# EAGLE design io_board (EAGLE 7.2.0)
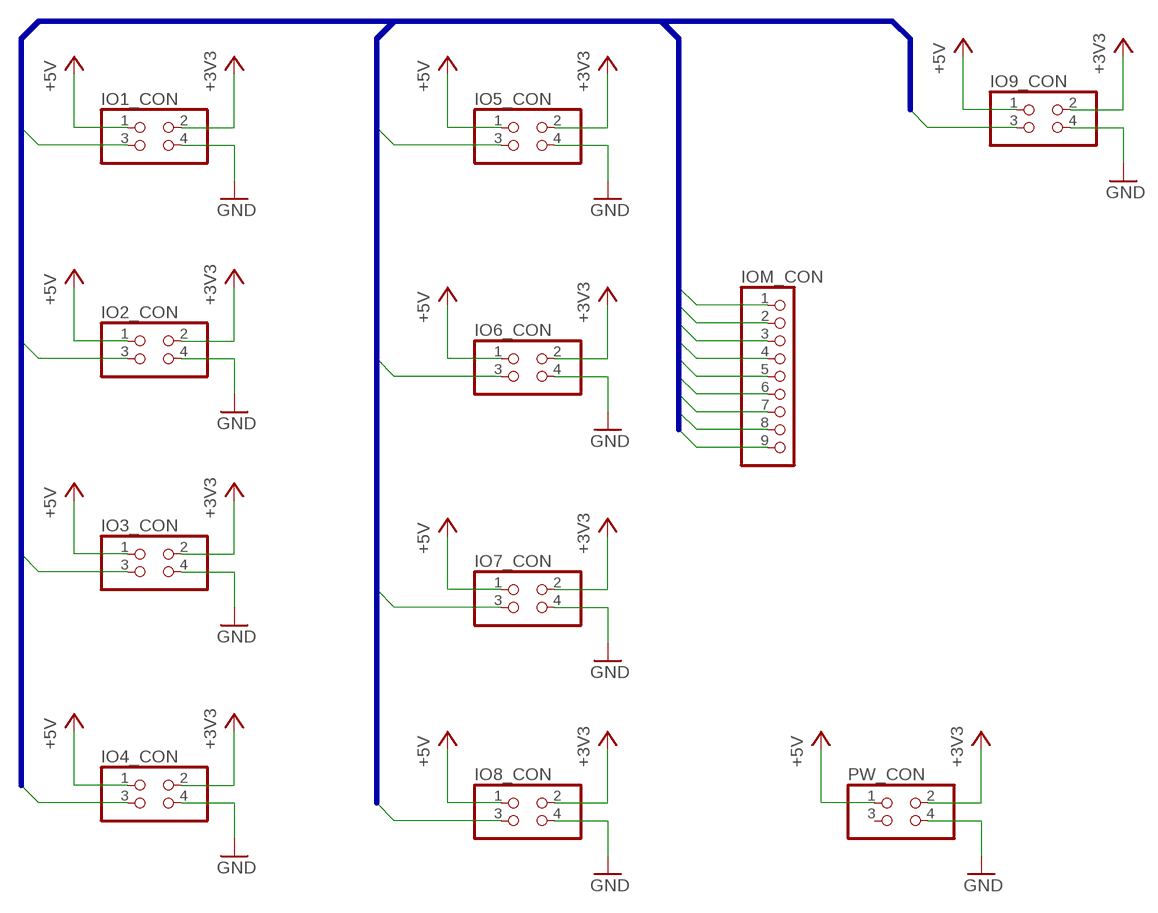
[diagram p0: schematic, sheet 1]

## Parts
IO1_CON  PINHD-2X2  [2X02]
IO2_CON  PINHD-2X2  [2X02]
IO3_CON  PINHD-2X2  [2X02]
IO4_CON  PINHD-2X2  [2X02]
IO5_CON  PINHD-2X2  [2X02]
IO6_CON  PINHD-2X2  [2X02]
IO7_CON  PINHD-2X2  [2X02]
IO8_CON  PINHD-2X2  [2X02]
IO9_CON  PINHD-2X2  [2X02]
IOM_CON  PINHD-1X9  [1X09]
PW_CON  PINHD-2X2  [2X02]

## Nets
+3V3: IO1_CON.2 IO2_CON.2 IO3_CON.2 IO4_CON.2 IO5_CON.2 IO6_CON.2 IO7_CON.2 IO8_CON.2 IO9_CON.2 PW_CON.2
+5V: IO1_CON.1 IO2_CON.1 IO3_CON.1 IO4_CON.1 IO5_CON.1 IO6_CON.1 IO7_CON.1 IO8_CON.1 IO9_CON.1 PW_CON.1
GND: IO1_CON.4 IO2_CON.4 IO3_CON.4 IO4_CON.4 IO5_CON.4 IO6_CON.4 IO7_CON.4 IO8_CON.4 IO9_CON.4 PW_CON.4
IO0: IO1_CON.3 IOM_CON.1
IO1: IO2_CON.3 IOM_CON.2
IO2: IO3_CON.3 IOM_CON.3
IO3: IO4_CON.3 IOM_CON.4
IO4: IO5_CON.3 IOM_CON.5
IO5: IO6_CON.3 IOM_CON.6
IO6: IO7_CON.3 IOM_CON.7
IO7: IO8_CON.3 IOM_CON.8
IO8: IO9_CON.3 IOM_CON.9
Unconnected: PW_CON.3

## Buses
IO[0..8]

## Library data of the parts
IO1_CON IO2_CON IO3_CON IO4_CON IO5_CON IO6_CON IO7_CON IO8_CON IO9_CON PW_CON = pinhead:PINHD-2X2: PIN HEADER
IOM_CON = pinhead:PINHD-1X9: PIN HEADER

## Board
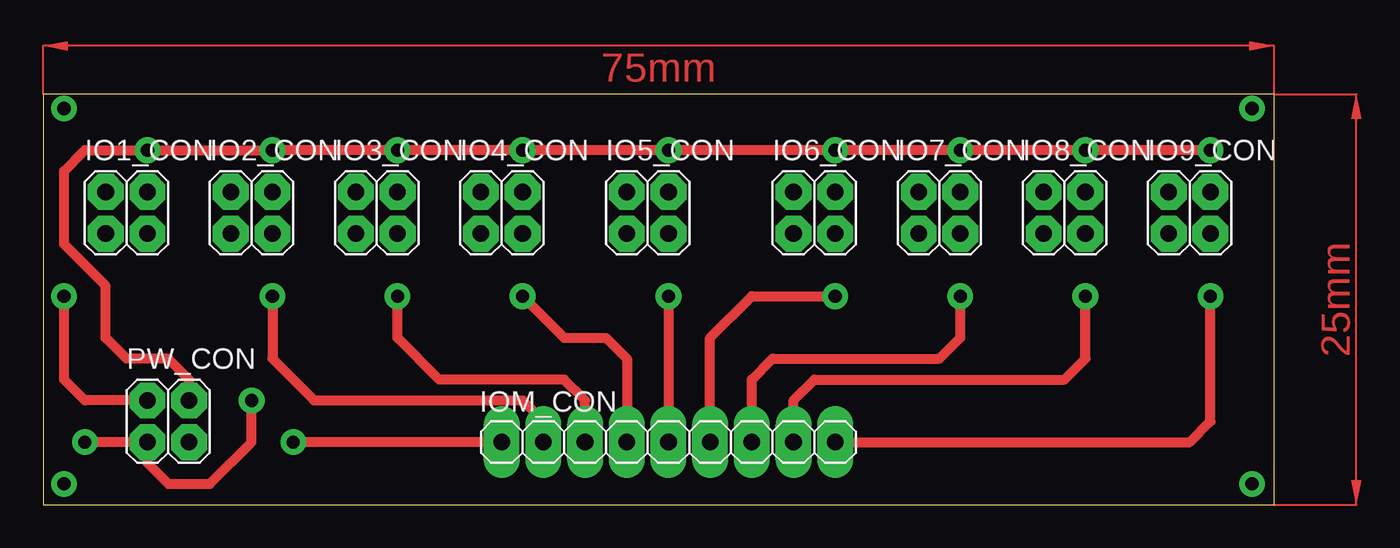
[diagram p1: board, top side]
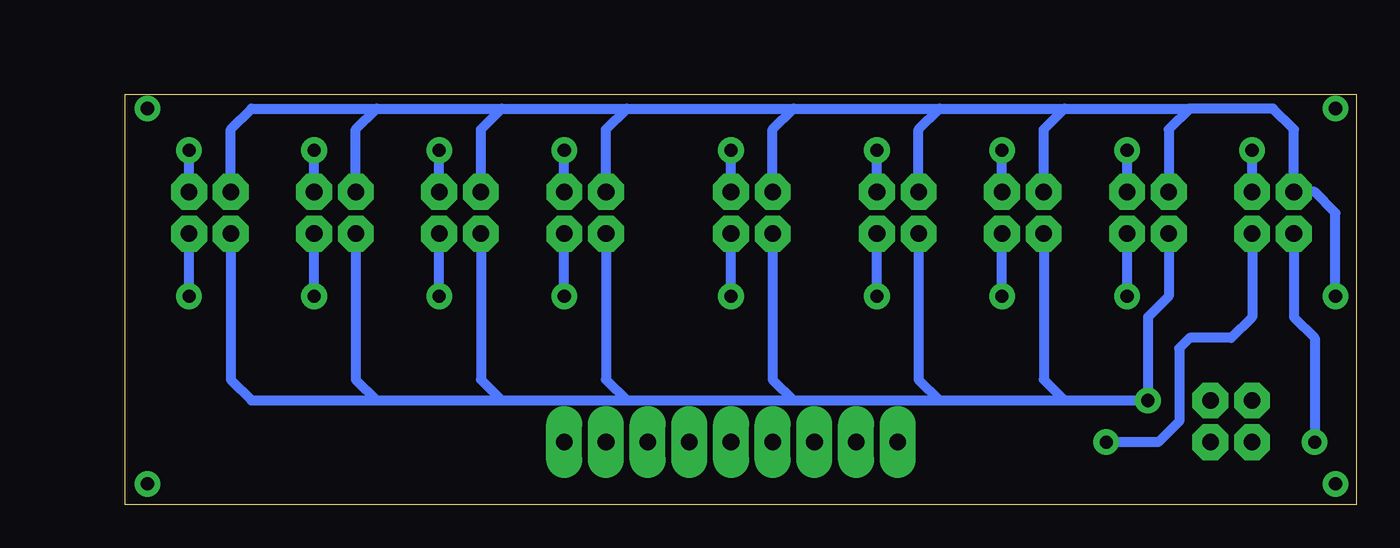
[diagram p2: board, bottom side, seen from below]

Size 75 x 25 mm. Coordinates in mm from the lower left corner, seen from the top.
Outline: 0,0 75,0 75,25 0,25 0,0
Copper layers (1*16): Top 0.035mm / dielectric 1.5mm / Bottom 0.035mm
Design rules "design-rules *": minimum track width 10mil, minimum drill 24mil, track to track 8mil, track to pad 8mil, pad to pad 8mil, via to via 8mil, smd to smd 8mil, copper to edge 40mil, drill to drill 8mil, minimum pad ring 23mil, minimum via ring 15mil, stop-mask expansion 4mil, vias tented up to drill 0mil, thermal gap 10mil

### Footprints (pad centres in the part's own frame; a part is rotated, then mirrored left to right if it is on the bottom)
2X02 = drill 1.016 octagon: 1 -1.27,-1.27; 2 -1.27,1.27; 3 1.27,-1.27; 4 1.27,1.27
1X09 = drill 1.016 long: 1 -10.16,0; 2 -7.62,0; 3 -5.08,0; 4 -2.54,0; 5 0,0; 6 2.54,0; 7 5.08,0; 8 7.62,0; 9 10.16,0

### Placement (x,y rotation side)
IO1_CON  5.08,17.78 0 top
IO2_CON  12.7,17.78 0 top
IO3_CON  20.32,17.78 0 top
IO4_CON  27.94,17.78 0 top
IO5_CON  36.83,17.78 0 top
IO6_CON  46.99,17.78 0 top
IO7_CON  54.61,17.78 0 top
IO8_CON  62.23,17.78 0 top
IO9_CON  69.85,17.78 0 top
IOM_CON  38.1,3.81 0 top
PW_CON  7.62,5.08 0 top

### Tracks (layer width: path | path; a pad name or v marks a point on that pad's centre or on a via)
+3V3  (via drill 0.8)
  Top 0.61: PW_CON.2 2.54,6.35 1.27,7.62 v1.27,12.7
  Bottom 0.61: v1.27,12.7 1.27,17.78 2.54,19.05 IO1_CON.2 3.81,22.86 5.08,24.13 10.16,24.13 | 10.16,24.13 11.43,22.86 IO2_CON.2 | IO3_CON.2 19.05,22.86 17.78,24.13 | 17.78,24.13 10.16,24.13 | IO4_CON.2 26.67,22.86 25.4,24.13 | 25.4,24.13 17.78,24.13 | IO5_CON.2 35.56,22.86 34.29,24.13 | 34.29,24.13 25.4,24.13 | IO6_CON.2 45.72,22.86 44.45,24.13 | 44.45,24.13 34.29,24.13 | IO7_CON.2 53.34,22.86 52.07,24.13 | 52.07,24.13 44.45,24.13 | IO8_CON.2 60.96,22.86 59.69,24.13 | 59.69,24.13 52.07,24.13 | IO9_CON.2 68.58,22.86 67.31,24.13 59.69,24.13
+5V  (via drill 0.8)
  Top 0.61: v12.7,6.35 12.7,3.81 10.16,1.27 7.62,1.27 6.35,2.54 PW_CON.1 v2.54,3.81
  Bottom 0.61: IO4_CON.1 26.67,7.62 25.4,6.35 | 25.4,6.35 17.78,6.35 | 17.78,6.35 v12.7,6.35 12.7,11.43 11.43,12.7 IO2_CON.1 | IO3_CON.1 19.05,7.62 17.78,6.35 | IO5_CON.1 35.56,7.62 34.29,6.35 | 34.29,6.35 25.4,6.35 | IO6_CON.1 45.72,7.62 44.45,6.35 | 44.45,6.35 34.29,6.35 | IO7_CON.1 53.34,7.62 52.07,6.35 | 52.07,6.35 44.45,6.35 | IO8_CON.1 60.96,7.62 59.69,6.35 | 59.69,6.35 52.07,6.35 | IO9_CON.1 68.58,7.62 67.31,6.35 59.69,6.35 | IO1_CON.1 3.81,11.43 2.54,10.16 v2.54,3.81
GND  (via drill 0.8)
  Top 0.61: v71.12,21.59 v63.5,21.59 v55.88,21.59 v48.26,21.59 v38.1,21.59 v29.21,21.59 v21.59,21.59 v13.97,21.59 v6.35,21.59 2.54,21.59 1.27,20.32 1.27,15.88 3.81,13.34 3.81,10.16 5.08,8.89 7.62,8.89 8.89,7.62 PW_CON.4
  Bottom 0.61: v13.97,21.59 IO2_CON.4 | IO3_CON.4 v21.59,21.59 | IO4_CON.4 v29.21,21.59 | IO5_CON.4 v38.1,21.59 | IO6_CON.4 v48.26,21.59 | IO7_CON.4 v55.88,21.59 | IO8_CON.4 v63.5,21.59 | IO9_CON.4 v71.12,21.59 | IO1_CON.4 v6.35,21.59
IO0  (via drill 0.8)
  Top 0.61: IOM_CON.1 v15.24,3.81
  Bottom 0.61: IO1_CON.3 6.35,11.43 7.62,10.16 10.16,10.16 10.79,9.53 10.79,5.08 12.06,3.81 v15.24,3.81
IO1  (via drill 0.8)
  Top 0.61: v13.97,12.7 13.97,8.89 16.51,6.35 29.21,6.35 30.48,5.08 IOM_CON.2
  Bottom 0.61: IO2_CON.3 v13.97,12.7
IO2  (via drill 0.8)
  Top 0.61: IOM_CON.3 33.02,6.35 31.75,7.62 24.13,7.62 21.59,10.16 v21.59,12.7
  Bottom 0.61: v21.59,12.7 IO3_CON.3
IO3  (via drill 0.8)
  Top 0.61: v29.21,12.7 31.75,10.16 34.29,10.16 35.56,8.89 IOM_CON.4
  Bottom 0.61: v29.21,12.7 IO4_CON.3
IO4  (via drill 0.8)
  Top 0.61: v38.1,12.7 IOM_CON.5
  Bottom 0.61: v38.1,12.7 IO5_CON.3
IO5  (via drill 0.8)
  Top 0.61: IOM_CON.6 40.64,10.16 43.18,12.7 v48.26,12.7
  Bottom 0.61: v48.26,12.7 IO6_CON.3
IO6  (via drill 0.8)
  Top 0.61: IOM_CON.7 43.18,7.62 44.45,8.89 54.61,8.89 55.88,10.16 v55.88,12.7
  Bottom 0.61: v55.88,12.7 IO7_CON.3
IO7  (via drill 0.8)
  Top 0.61: IOM_CON.8 45.72,6.35 46.99,7.62 62.23,7.62 63.5,8.89 v63.5,12.7
  Bottom 0.61: v63.5,12.7 IO8_CON.3
IO8  (via drill 0.8)
  Top 0.61: IOM_CON.9 69.85,3.81 71.12,5.08 v71.12,12.7
  Bottom 0.61: v71.12,12.7 IO9_CON.3
N$1  (via drill 0.8)
  other vias: 1.27,24.13
N$2  (via drill 0.8)
  other vias: 73.66,24.13
N$3  (via drill 0.8)
  other vias: 73.66,1.27
N$4  (via drill 0.8)
  other vias: 1.27,1.27
(copper drawn outside any net)
  shapes: Top area x2